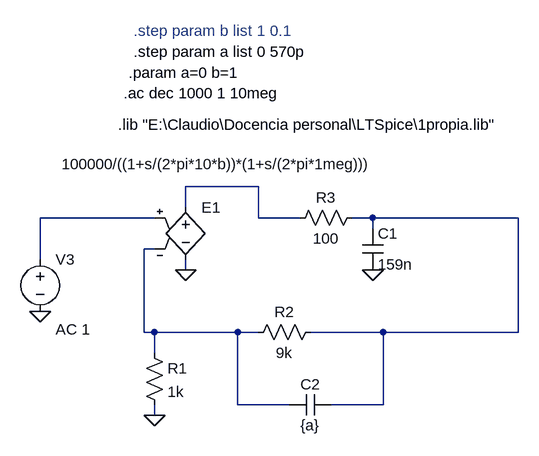
[diagram p0: schematic parcial 1 e3 2024.asc]
parcial 1 e3 2024.asc, the LTspice schematic file:
Version 4
SHEET 1 1336 680
WIRE 352 -48 240 -48
WIRE 240 -16 240 -48
WIRE 192 0 16 0
WIRE 352 0 352 -48
WIRE 416 0 352 0
WIRE 528 0 496 0
WIRE 752 0 528 0
WIRE 528 16 528 0
WIRE 192 48 176 48
WIRE 16 64 16 0
WIRE 240 80 240 64
WIRE 176 176 176 48
WIRE 192 176 176 176
WIRE 320 176 192 176
WIRE 352 176 320 176
WIRE 544 176 432 176
WIRE 752 176 752 0
WIRE 752 176 544 176
WIRE 192 208 192 176
WIRE 320 288 320 176
WIRE 400 288 320 288
WIRE 544 288 544 176
WIRE 544 288 464 288
WIRE 192 304 192 288
FLAG 16 144 0
FLAG 192 304 0
FLAG 240 80 0
FLAG 528 80 0
SYMBOL voltage 16 48 R0
WINDOW 123 24 124 Left 2
WINDOW 39 0 0 Left 0
SYMATTR Value2 AC 1
SYMATTR InstName V3
SYMATTR Value ""
SYMBOL res 176 192 R0
SYMATTR InstName R1
SYMATTR Value 1k
SYMBOL res 448 160 R90
WINDOW 0 0 56 VBottom 2
WINDOW 3 32 56 VTop 2
SYMATTR InstName R2
SYMATTR Value 9k
SYMBOL res 512 -16 R90
WINDOW 0 0 56 VBottom 2
WINDOW 3 32 56 VTop 2
SYMATTR InstName R3
SYMATTR Value 100
SYMBOL cap 512 16 R0
SYMATTR InstName C1
SYMATTR Value 159n
SYMBOL e 240 -32 R0
WINDOW 3 -191 -51 Left 2
SYMATTR Value 100000/((1+s/(2*pi*10*b))*(1+s/(2*pi*1meg)))
SYMATTR InstName E1
SYMATTR SpiceModel laplace
SYMBOL cap 464 272 R90
WINDOW 0 0 32 VBottom 2
WINDOW 3 32 32 VTop 2
SYMATTR InstName C2
SYMATTR Value {a}
TEXT 136 -144 Left 2 !.lib "E:\\Claudio\\Docencia personal\\LTSpice\\1propia.lib"
TEXT 144 -192 Left 2 !.ac dec 1000 1 10meg
TEXT 152 -224 Left 2 !.param a=0 b=1
TEXT 160 -256 Left 2 !.step param a list 0 570p
TEXT 160 -288 Left 2 ;.step param b list 1 0.1

The netlist it stands for:
* parcial 1 e3 2024.asc
V3 N002 0 AC 1
R1 N004 0 1k
R2 N003 N004 9k
R3 N003 N001 100
C1 N003 0 159n
E1 N001 0 N002 N004 laplace 100000/((1+s/(2*pi*10*b))*(1+s/(2*pi*1meg)))
C2 N003 N004 {a}
.lib "E:\Claudio\Docencia personal\LTSpice\1propia.lib"
.ac dec 1000 1 10meg
.param a=0 b=1
.step param a list 0 570p
* .step param b list 1 0.1
.backanno
.end